# EAGLE schematic linearni_zdroj (EAGLE 9.5.1)
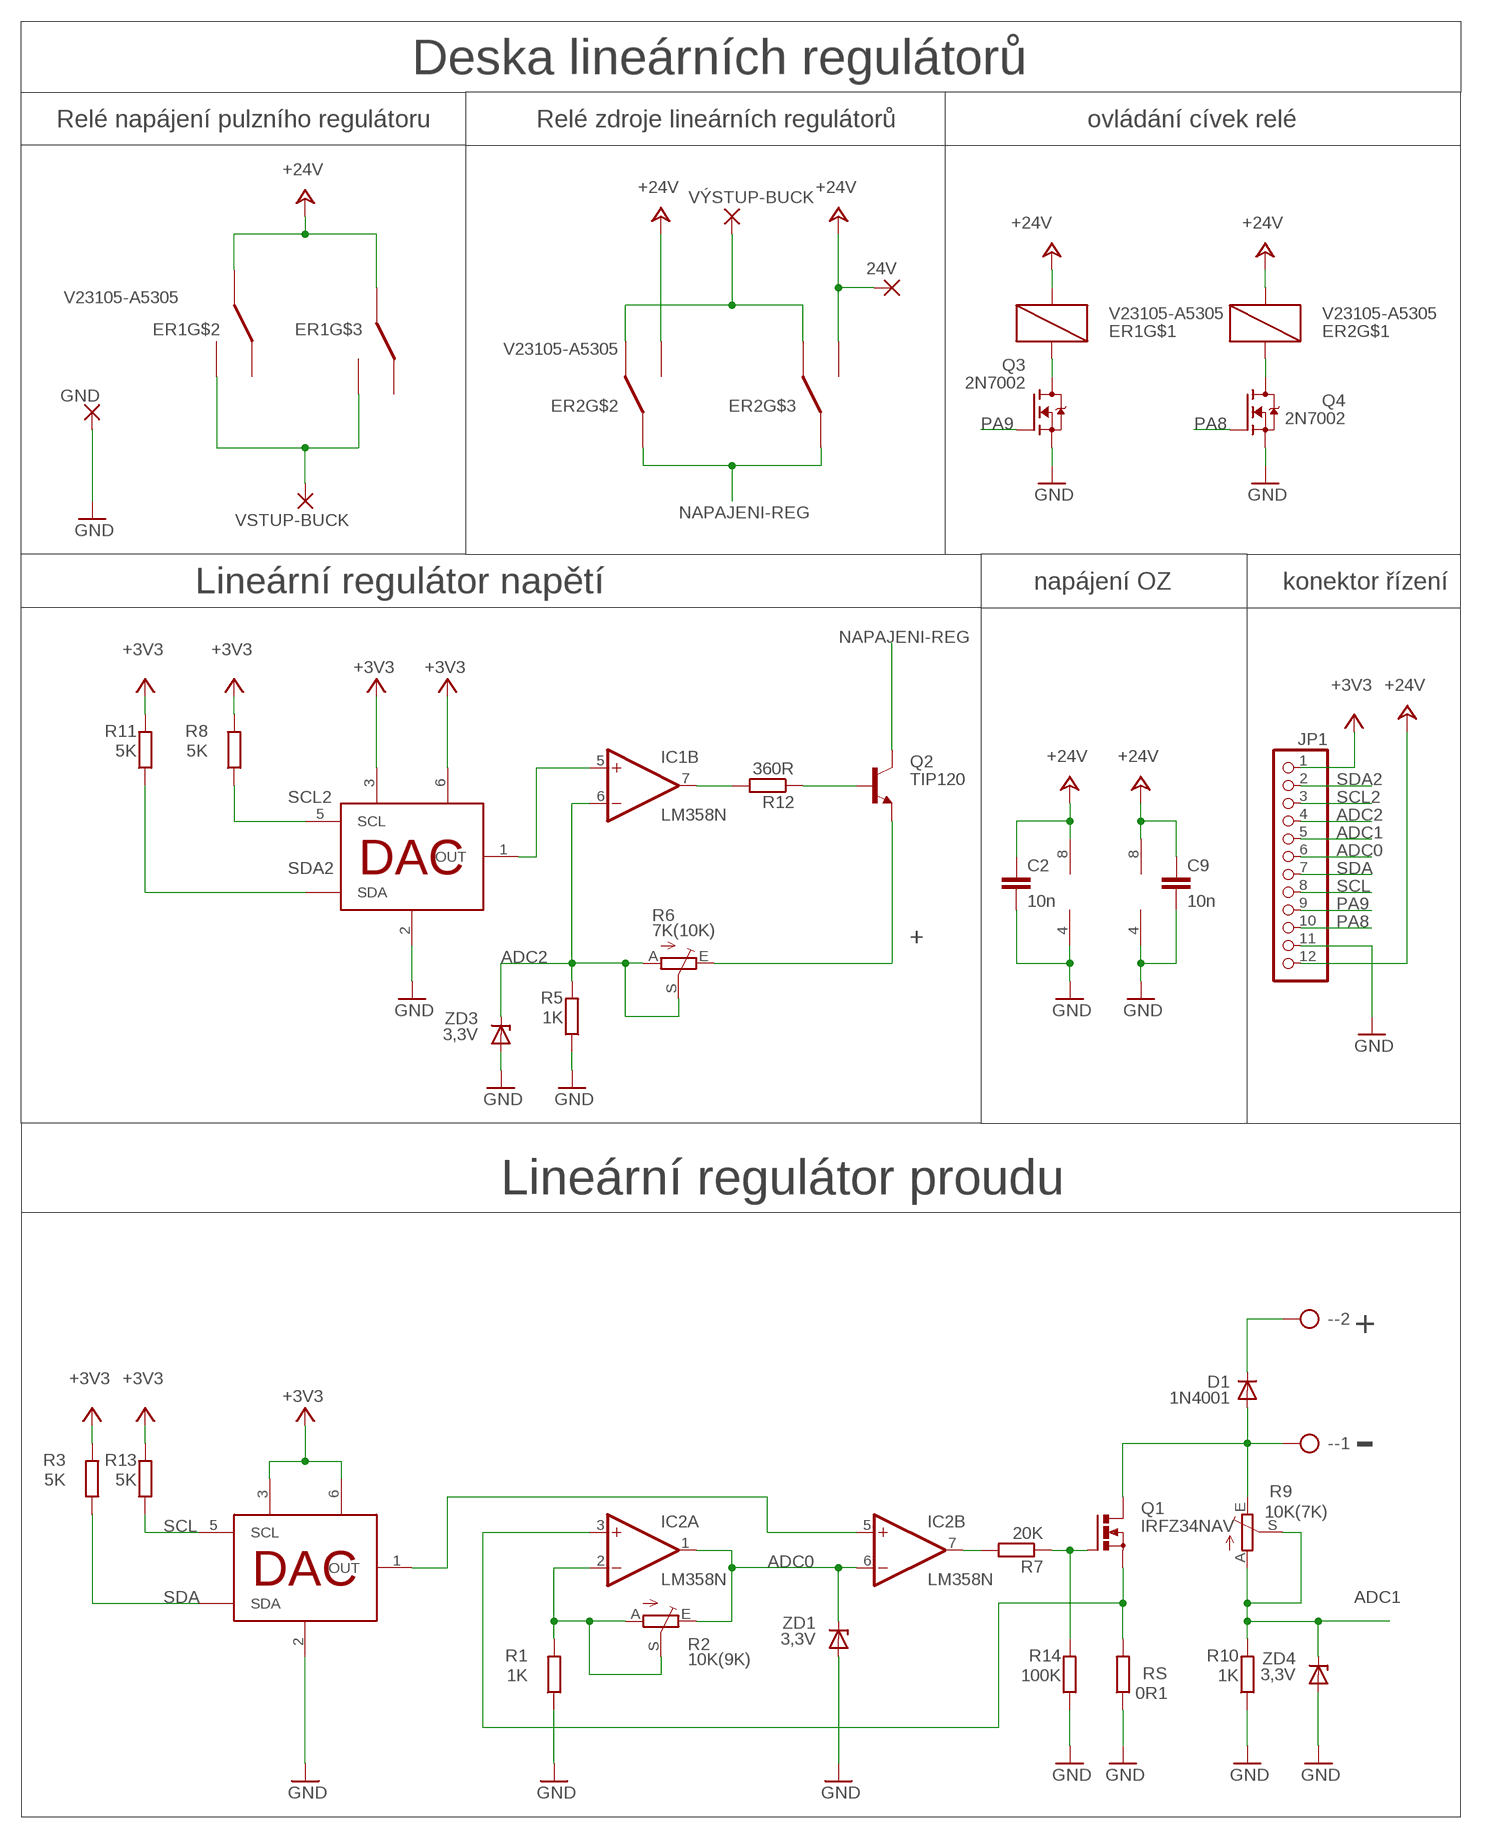
[diagram p0: schematic, sheet 1]

## Parts
24V  3,81/1,4  [3,81/1,4]
-  AK500/2  [AK500/2]
C2  10n  C-EUC0805  [C0805]
C9  10n  C-EUC0805  [C0805]
D1  1N4001  DIODE7  [DO35-7B]
ER1  V23105-A5305  V23105-A5305-A201  [V23105-A5305-A201]
ER2  V23105-A5305  V23105-A5305-A201  [V23105-A5305-A201]
GND  3,81/1,4  [3,81/1,4]
IC1  LM358N  [DIL08]
IC2  LM358N  [DIL08]
JP1  PINHD-1X12  [1X12]
Q1  IRFZ34NAV  [TO220AV]
Q2  TIP120  -NPN-TO220V  [TO220V]
Q3  2N7002  NX3008  [SOT95P240X110-3N]
Q4  2N7002  NX3008  [SOT95P240X110-3N]
R1  1K  R-EU_R0805  [R0805]
R2  10K(9K)  TRIM_EU-CA6V  [CA6V]
R3  5K  R-EU_R0805  [R0805]
R5  1K  R-EU_R0805  [R0805]
R6  7K(10K)  TRIM_EU-CA6V  [CA6V]
R7  20K  R-EU_R0805  [R0805]
R8  5K  R-EU_R0805  [R0805]
R9  10K(7K)  TRIM_EU-CA6V  [CA6V]
R10  1K  R-EU_R0805  [R0805]
R11  5K  R-EU_R0805  [R0805]
R12  360R  R-EU_R0805  [R0805]
R13  5K  R-EU_R0805  [R0805]
R14  100K  R-EU_R0805  [R0805]
RS  0R1  R-EU_0411/15  [0411/15]
U$5  MCP4726  [TSOT23-6]
U$6  MCP4726  [TSOT23-6]
VSTUP-BUCK  3,81/1,4  [3,81/1,4]
VÝSTUP-BUCK  3,81/1,4  [3,81/1,4]
ZD1  3,3V  DIODE_ZENER"2  [MINIMELF]
ZD3  3,3V  DIODE_ZENER"2  [MINIMELF]
ZD4  3,3V  DIODE_ZENER"2  [MINIMELF]

## Nets
+: -.2 D1.C Q2.3(E) R6.E
+3V3: JP1.1 R3.2 R8.2 R11.2 R13.2 U$5.3(VDD) U$5.6(VREF) U$6.3(VDD) U$6.6(VREF)
+24V: 24V.1(P) C2.1 C9.1 ER1.1(C$1) ER1.4 ER1.13 ER2.1(C$1) ER2.8 ER2.9 IC1.8(P:V+) IC2.8(P:V+) JP1.12
ADC0: IC2.1(A:OUT) IC2.6(B:-IN) JP1.6 R2.E ZD1.C
ADC1: JP1.5 R9.A R9.S R10.2 ZD4.C
ADC2: IC1.6(B:-IN) JP1.4 R5.2 R6.A R6.S ZD3.C
GND: C2.2 C9.2 GND.1(P) IC1.4(P:V-) IC2.4(P:V-) JP1.11 Q3.2(S) Q4.2(S) R1.1 R5.1 R10.1 R14.1 RS.1 U$5.2(VSS) U$6.2(VSS) ZD1.A ZD3.A ZD4.A
N$1: IC2.7(B:OUT) R7.2
N$2: Q1.G R7.1 R14.2
N$3: IC2.2(A:-IN) R1.2 R2.A R2.S
N$4: Q2.1(B) R12.1
N$6: IC2.5(B:+IN) U$5.1(OUT)
N$7: -.1 D1.A Q1.D R9.E
N$9: IC1.5(B:+IN) U$6.1(OUT)
N$10: ER2.6 ER2.11 VÝSTUP-BUCK.1(P)
N$12: IC1.7(B:OUT) R12.2
N$16: ER1.16(C$2) Q3.3(D)
N$17: ER2.16(C$2) Q4.3(D)
N$19: ER1.8 ER1.9 VSTUP-BUCK.1(P)
N$20: IC2.3(A:+IN) Q1.S RS.2
NAPAJENI-REG: ER2.4 ER2.13 Q2.2(C)
PA8: JP1.10 Q4.1(G)
PA9: JP1.9 Q3.1(G)
SCL: JP1.8 R13.1 U$5.5(SCL)
SCL2: JP1.3 R8.1 U$6.5(SCL)
SDA: JP1.7 R3.1 U$5.4(SDA)
SDA2: JP1.2 R11.1 U$6.4(SDA)
Unconnected: ER1.6 ER1.11 IC1.1(A:OUT) IC1.2(A:-IN) IC1.3(A:+IN)

## Notes on the sheet
- Deska lineárních regulátorů
- Relé napájení pulzního regulátoru | Relé zdroje lineárních regulátorů | ovládání cívek relé
- Lineární regulátor napětí | napájení OZ | konektor řízení
- Lineární regulátor proudu
- -

## Library data of the parts
24V GND VSTUP-BUCK VÝSTUP-BUCK = wirepad:3,81/1,4: THROUGH-HOLE PAD
- = con-ptr500:AK500/2: CONNECTOR; OC_FARNELL: unknown; OC_NEWARK: unknown
C2 C9 = rcl:C-EU: CAPACITOR, European symbol; SPICEPREFIX: C
D1 = devices:DIODE
ER1 ER2 = realatka:V23105-A5305-A201
IC1 IC2 = linear:LM358: OP AMP also LM158; LM258; LM2904 Source: http://cache.national.com/ds/LM/LM158.pdf
JP1 = pinhead:PINHD-1X12: PIN HEADER
Q1 = devices:IRFZ34N
Q2 = transistor:*-NPN-: NPN Transistror BF959 corrected 2008.03.06
Q3 Q4 = NEXPERIA :NX3008
R1 R3 R5 R7 R8 R10-R14 RS = rcl:R-EU_: RESISTOR, European symbol; SPICEPREFIX: R
R2 R6 R9 = pot:TRIM_EU-: POTENTIOMETER
U$5 U$6 = DAC:MCP4726
ZD1 ZD3 ZD4 = devices:DIODE_ZENER